# EasyEDA Pro project MyDeskThingy.epro

# Schematic Schematic1
Board Name: Board1; Create Date: 2026-04-02; Page Name: P1; Project Name: MyDeskThingy; Schematic Name: Schematic1; Update Date: 2026-04-02; Company: EasyEDA.com; Page Size: A4; Version: V1.0
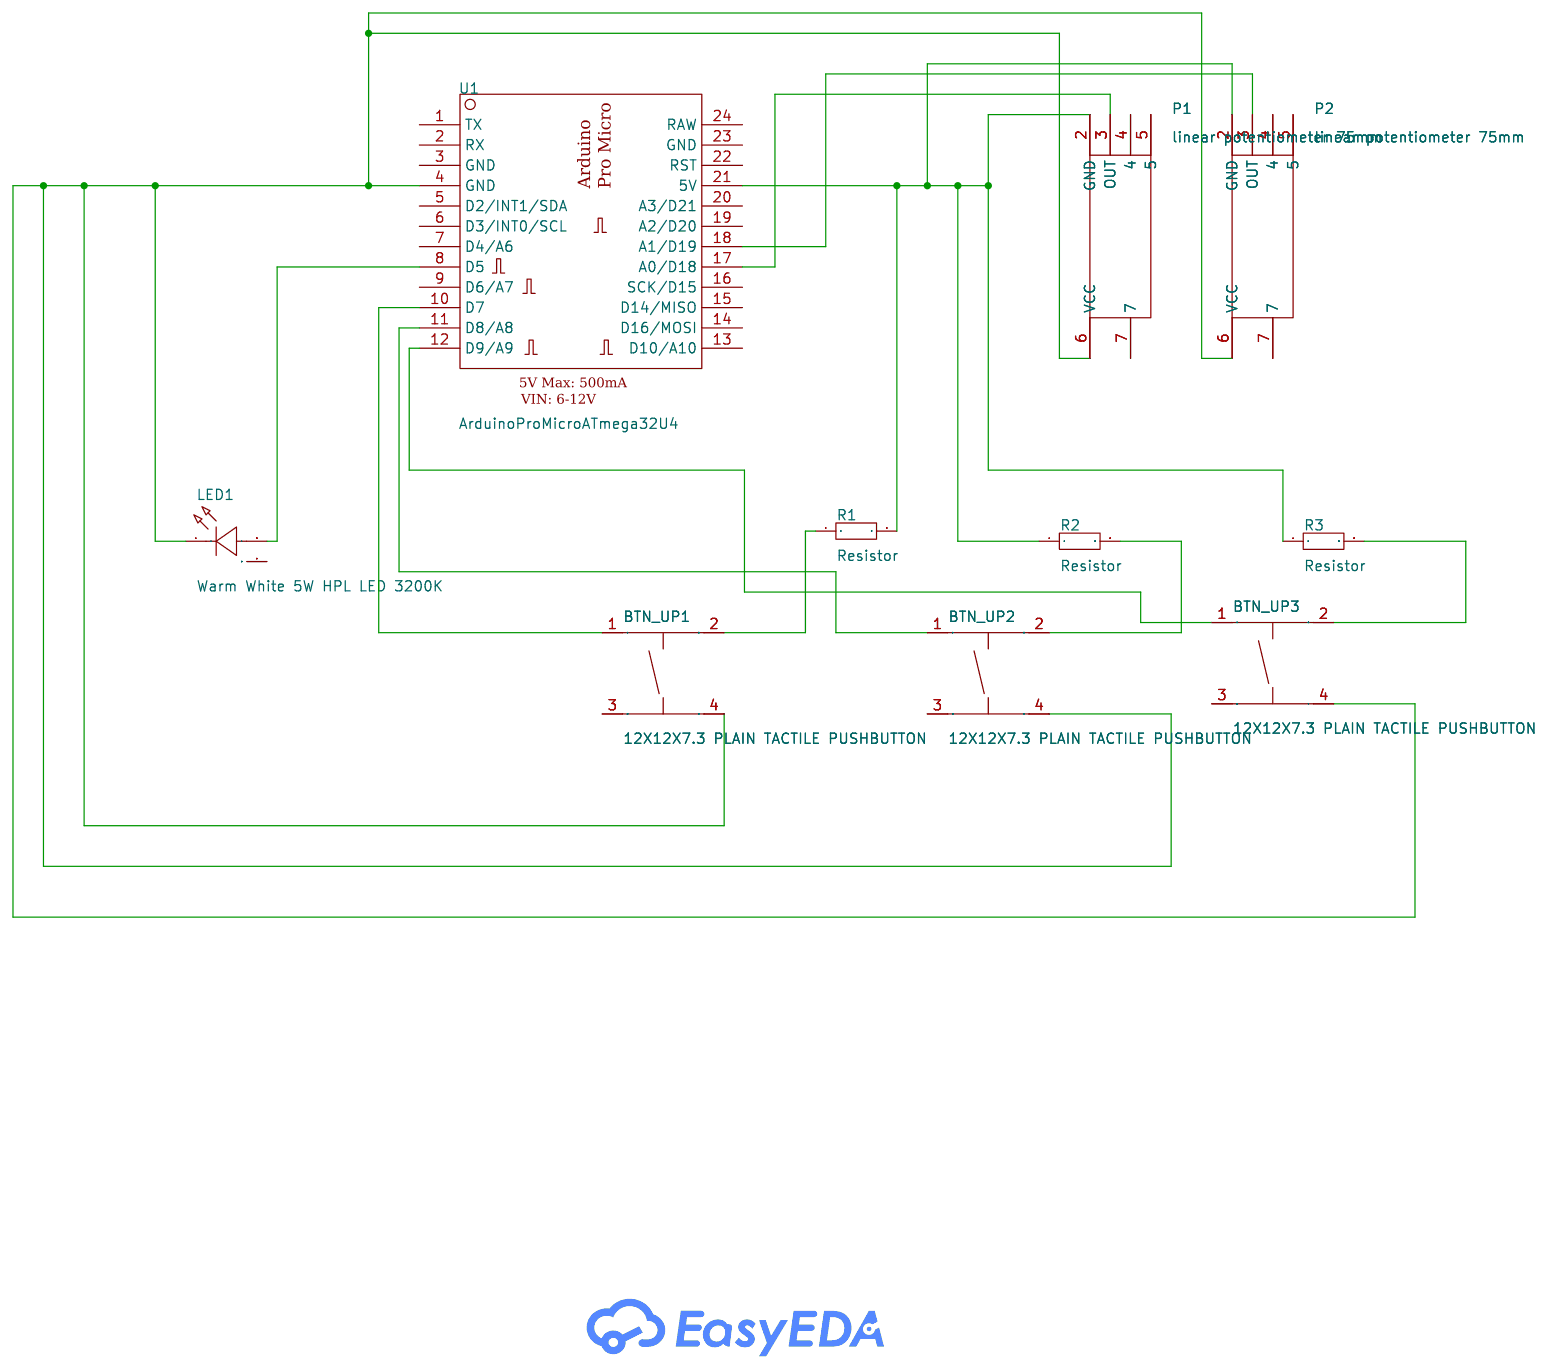
[diagram p0: schematic sheet]

## Parts
BTN_UP1  12X12X7.3 PLAIN TACTILE PUSHBUTTON  [SW-TH_4P-L12.0-W12.0-P5.00-LS12.5]
BTN_UP2  12X12X7.3 PLAIN TACTILE PUSHBUTTON  [SW-TH_4P-L12.0-W12.0-P5.00-LS12.5]
BTN_UP3  12X12X7.3 PLAIN TACTILE PUSHBUTTON  [SW-TH_4P-L12.0-W12.0-P5.00-LS12.5]
LED1  Warm White 5W HPL LED 3200K  [LED-SMD_HL-EF45W1NAMS_BIG]
P1  linear potentiometer 75mm  [MY Slide Pot 75mm]  (no BOM)
P2  linear potentiometer 75mm  [MY Slide Pot 75mm]  (no BOM)
R1  Resistor  [Resistor 1/8w 7mm metal film]
R2  Resistor  [Resistor 1/8w 7mm metal film]
R3  Resistor  [Resistor 1/8w 7mm metal film]
U1  ArduinoProMicroATmega32U4  [ARDUINOPROMICRO]

## Library data of the parts
BTN_UP1-BTN_UP3 = 12X12X7.3 PLAIN TACTILE PUSHBUTTON: Supplier: LCSC; Supplier Part: C10861; Manufacturer: Boom Precision Elec; JLCPCB Part Class: Extend; Paste Type: expand
LED1 = LC-5WW-C45: 2500K - 3500K, 6-7V, 600-700mA, Lumen 450-500 LM; Manufacturer: LCFOCUS; Supplier: LCFOCUS; Product Link: https://www.aliexpress.com/item/32881559687.html
P1 P2 = Slide Pot 75mm
R1-R3 = resistor: Supplier: LCSC; Manufacturer: UNI-ROYAL(Uniroyal Elec); Manufacturer Part: 1206W4F1002T5E; Supplier Part: C17902; Resistance: 10KΩ; JLCPCB Part Class: Basic Part; Datasheet: https://datasheet.lcsc.com/lcsc/2206010145_UNI-ROYAL-Uniroyal-Elec-1206W4F1002T5E_C17902.pdf
U1 = ArduinoProMicroATmega32U4

## Nets
$1N561: BTN_UP1.4 BTN_UP2.4 BTN_UP3.4 LED1.1(K) P1.6(VCC) P2.6(VCC) U1.4(GND)
$1N796: BTN_UP2.2 R2.2
$1N803: BTN_UP3.2 R3.2
$1N946: BTN_UP1.2 R1.1
$1N950: LED1.2(A) U1.8(D5)
$1N987: BTN_UP1.1 U1.10(D7)
$1N1002: BTN_UP2.1 U1.11(D8/A8)
$1N1010: BTN_UP3.1 U1.12(D9/A9)
$1N1032: P1.2(GND) P2.2(GND) R1.2 R2.1 R3.1 U1.21(5V)
$1N1123: P1.3(OUT) U1.17(A0/D18)
$1N1130: P2.3(OUT) U1.18(A1/D19)

Not connected (* = marked no-connect by the designer): BTN_UP1 3; BTN_UP2 3; BTN_UP3 3; LED1 3; P1 4 5 7; P2 4 5 7; U1 1(TX) 2(RX) 3(GND) 5(D2/INT1/SDA) 6(D3/INT0/SCL) 7(D4/A6) 9(D6/A7) 13(D10/A10) 14(D16/MOSI) 15(D14/MISO) 16(SCK/D15) 19(A2/D20) 20(A3/D21) 22(RST) 23(GND) 24(RAW)

# Board PCB1
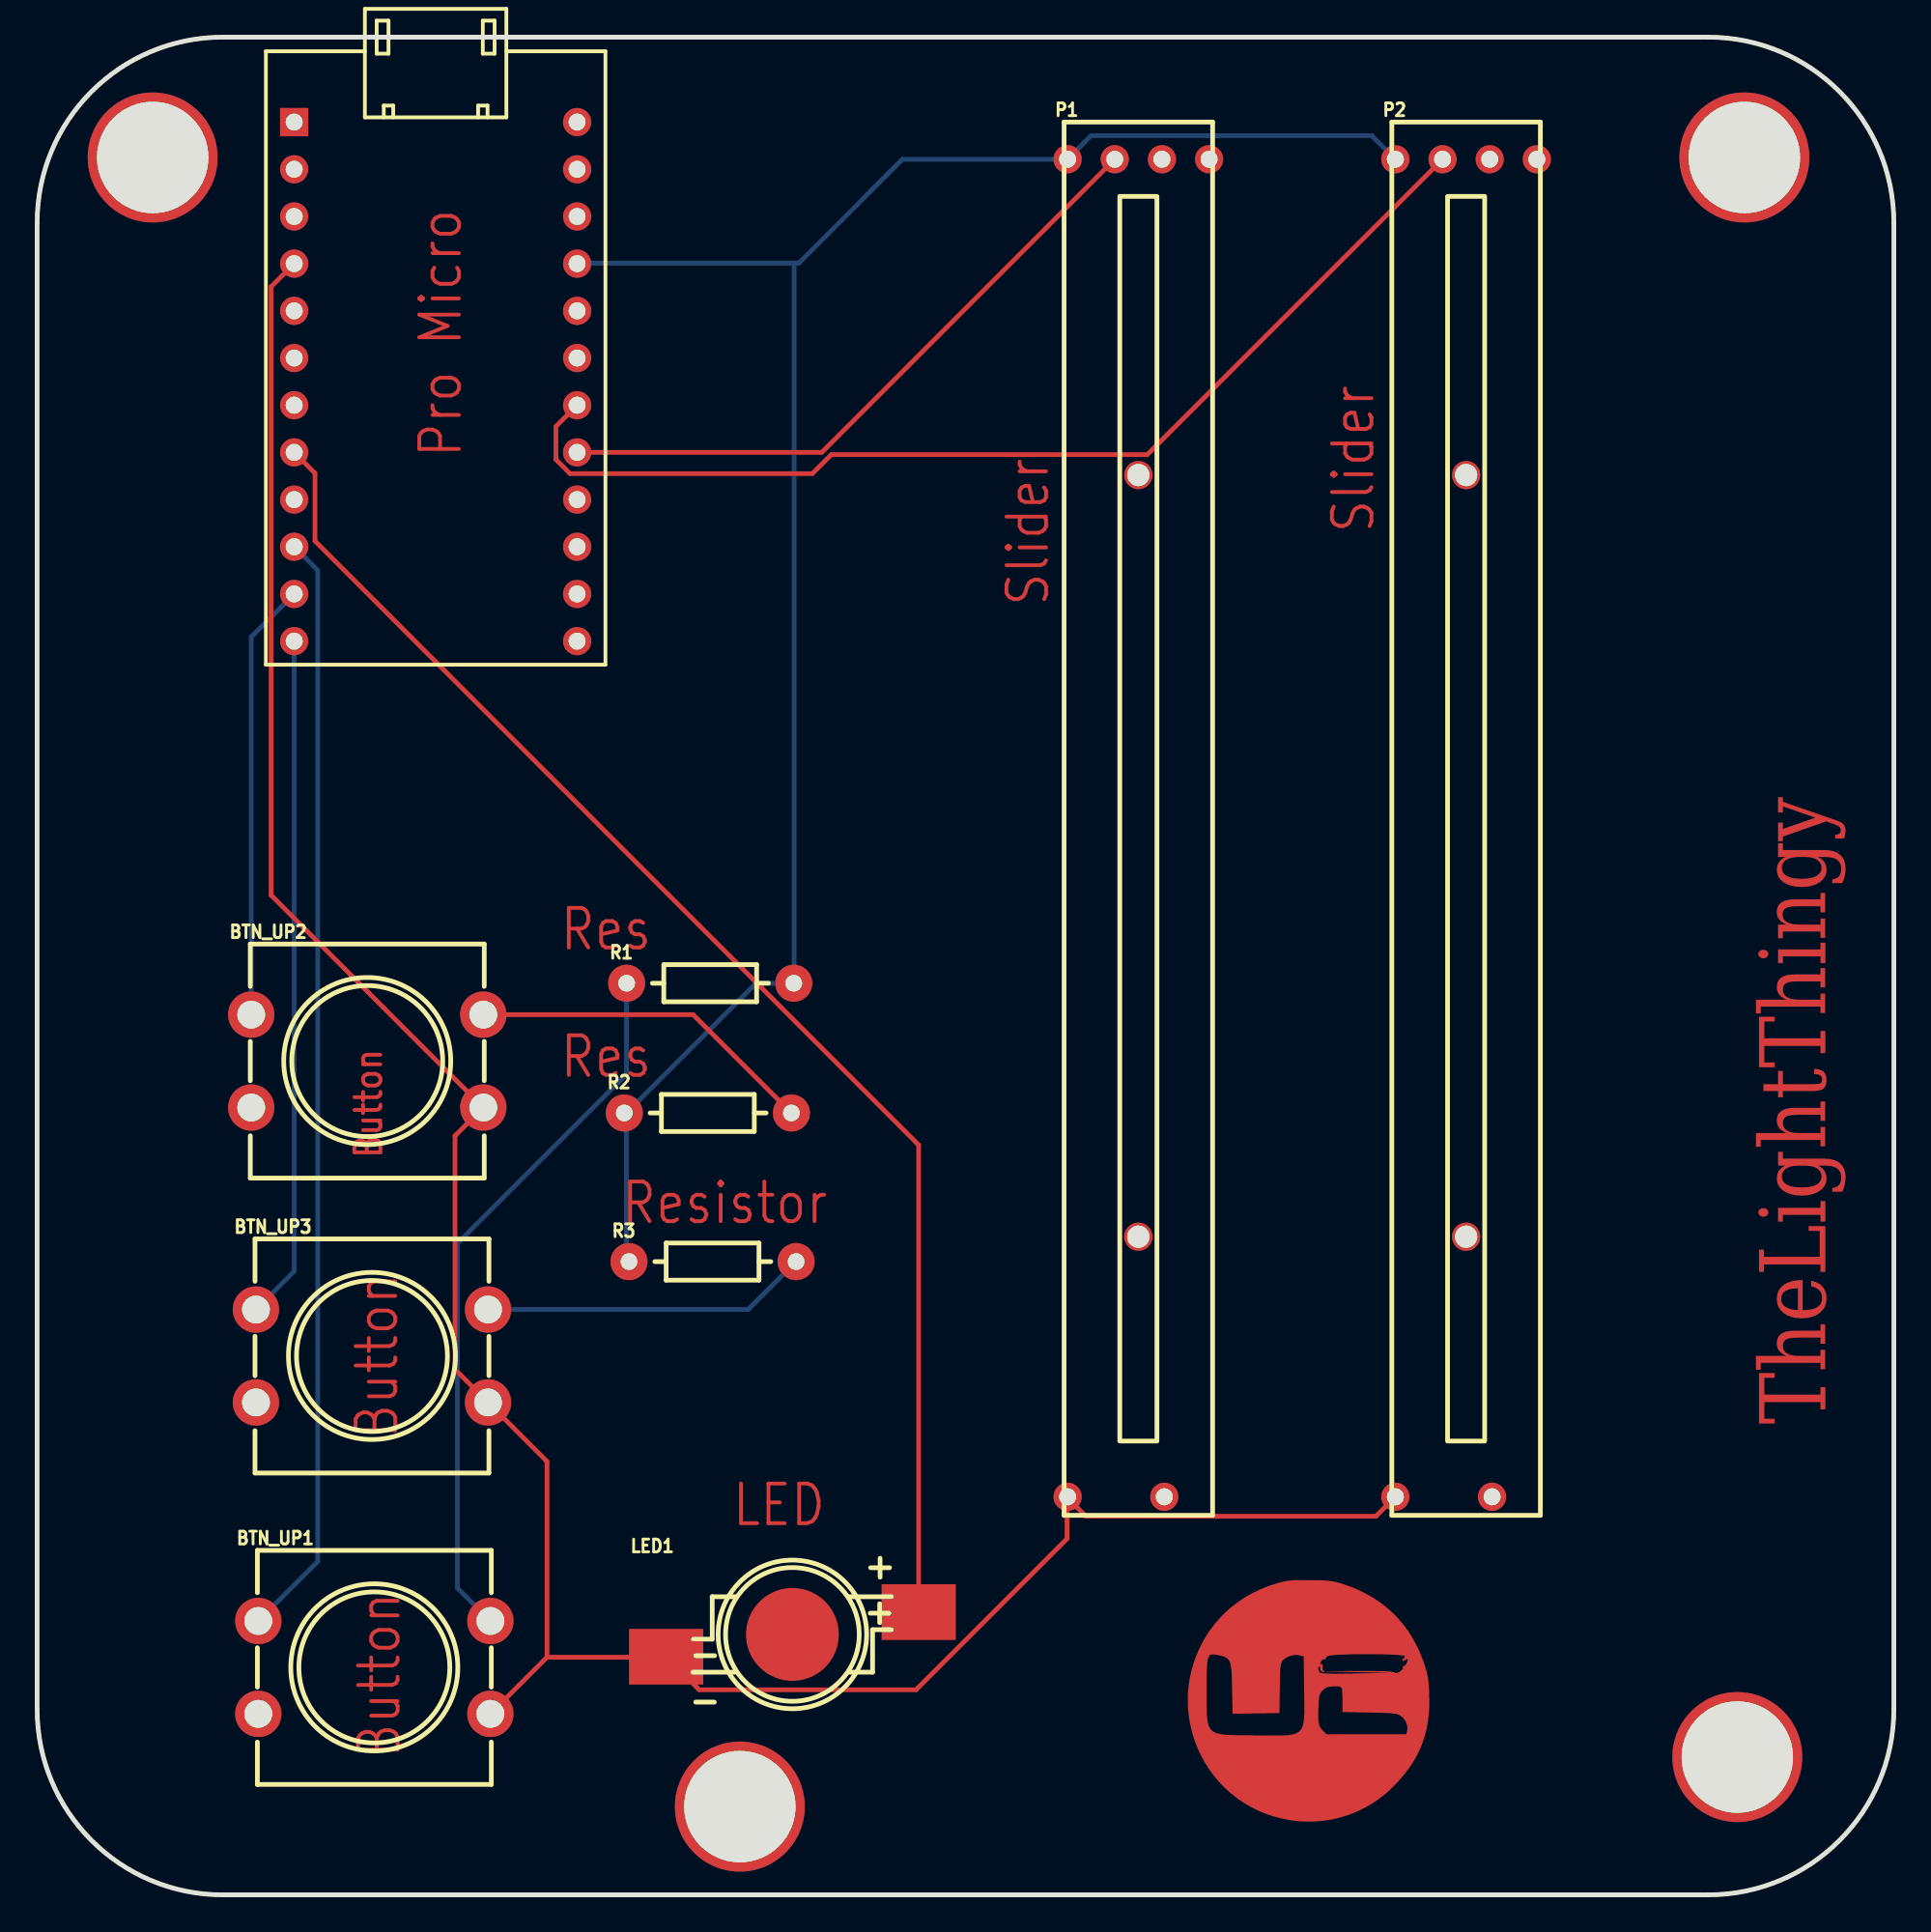
[diagram p1: board, top side]
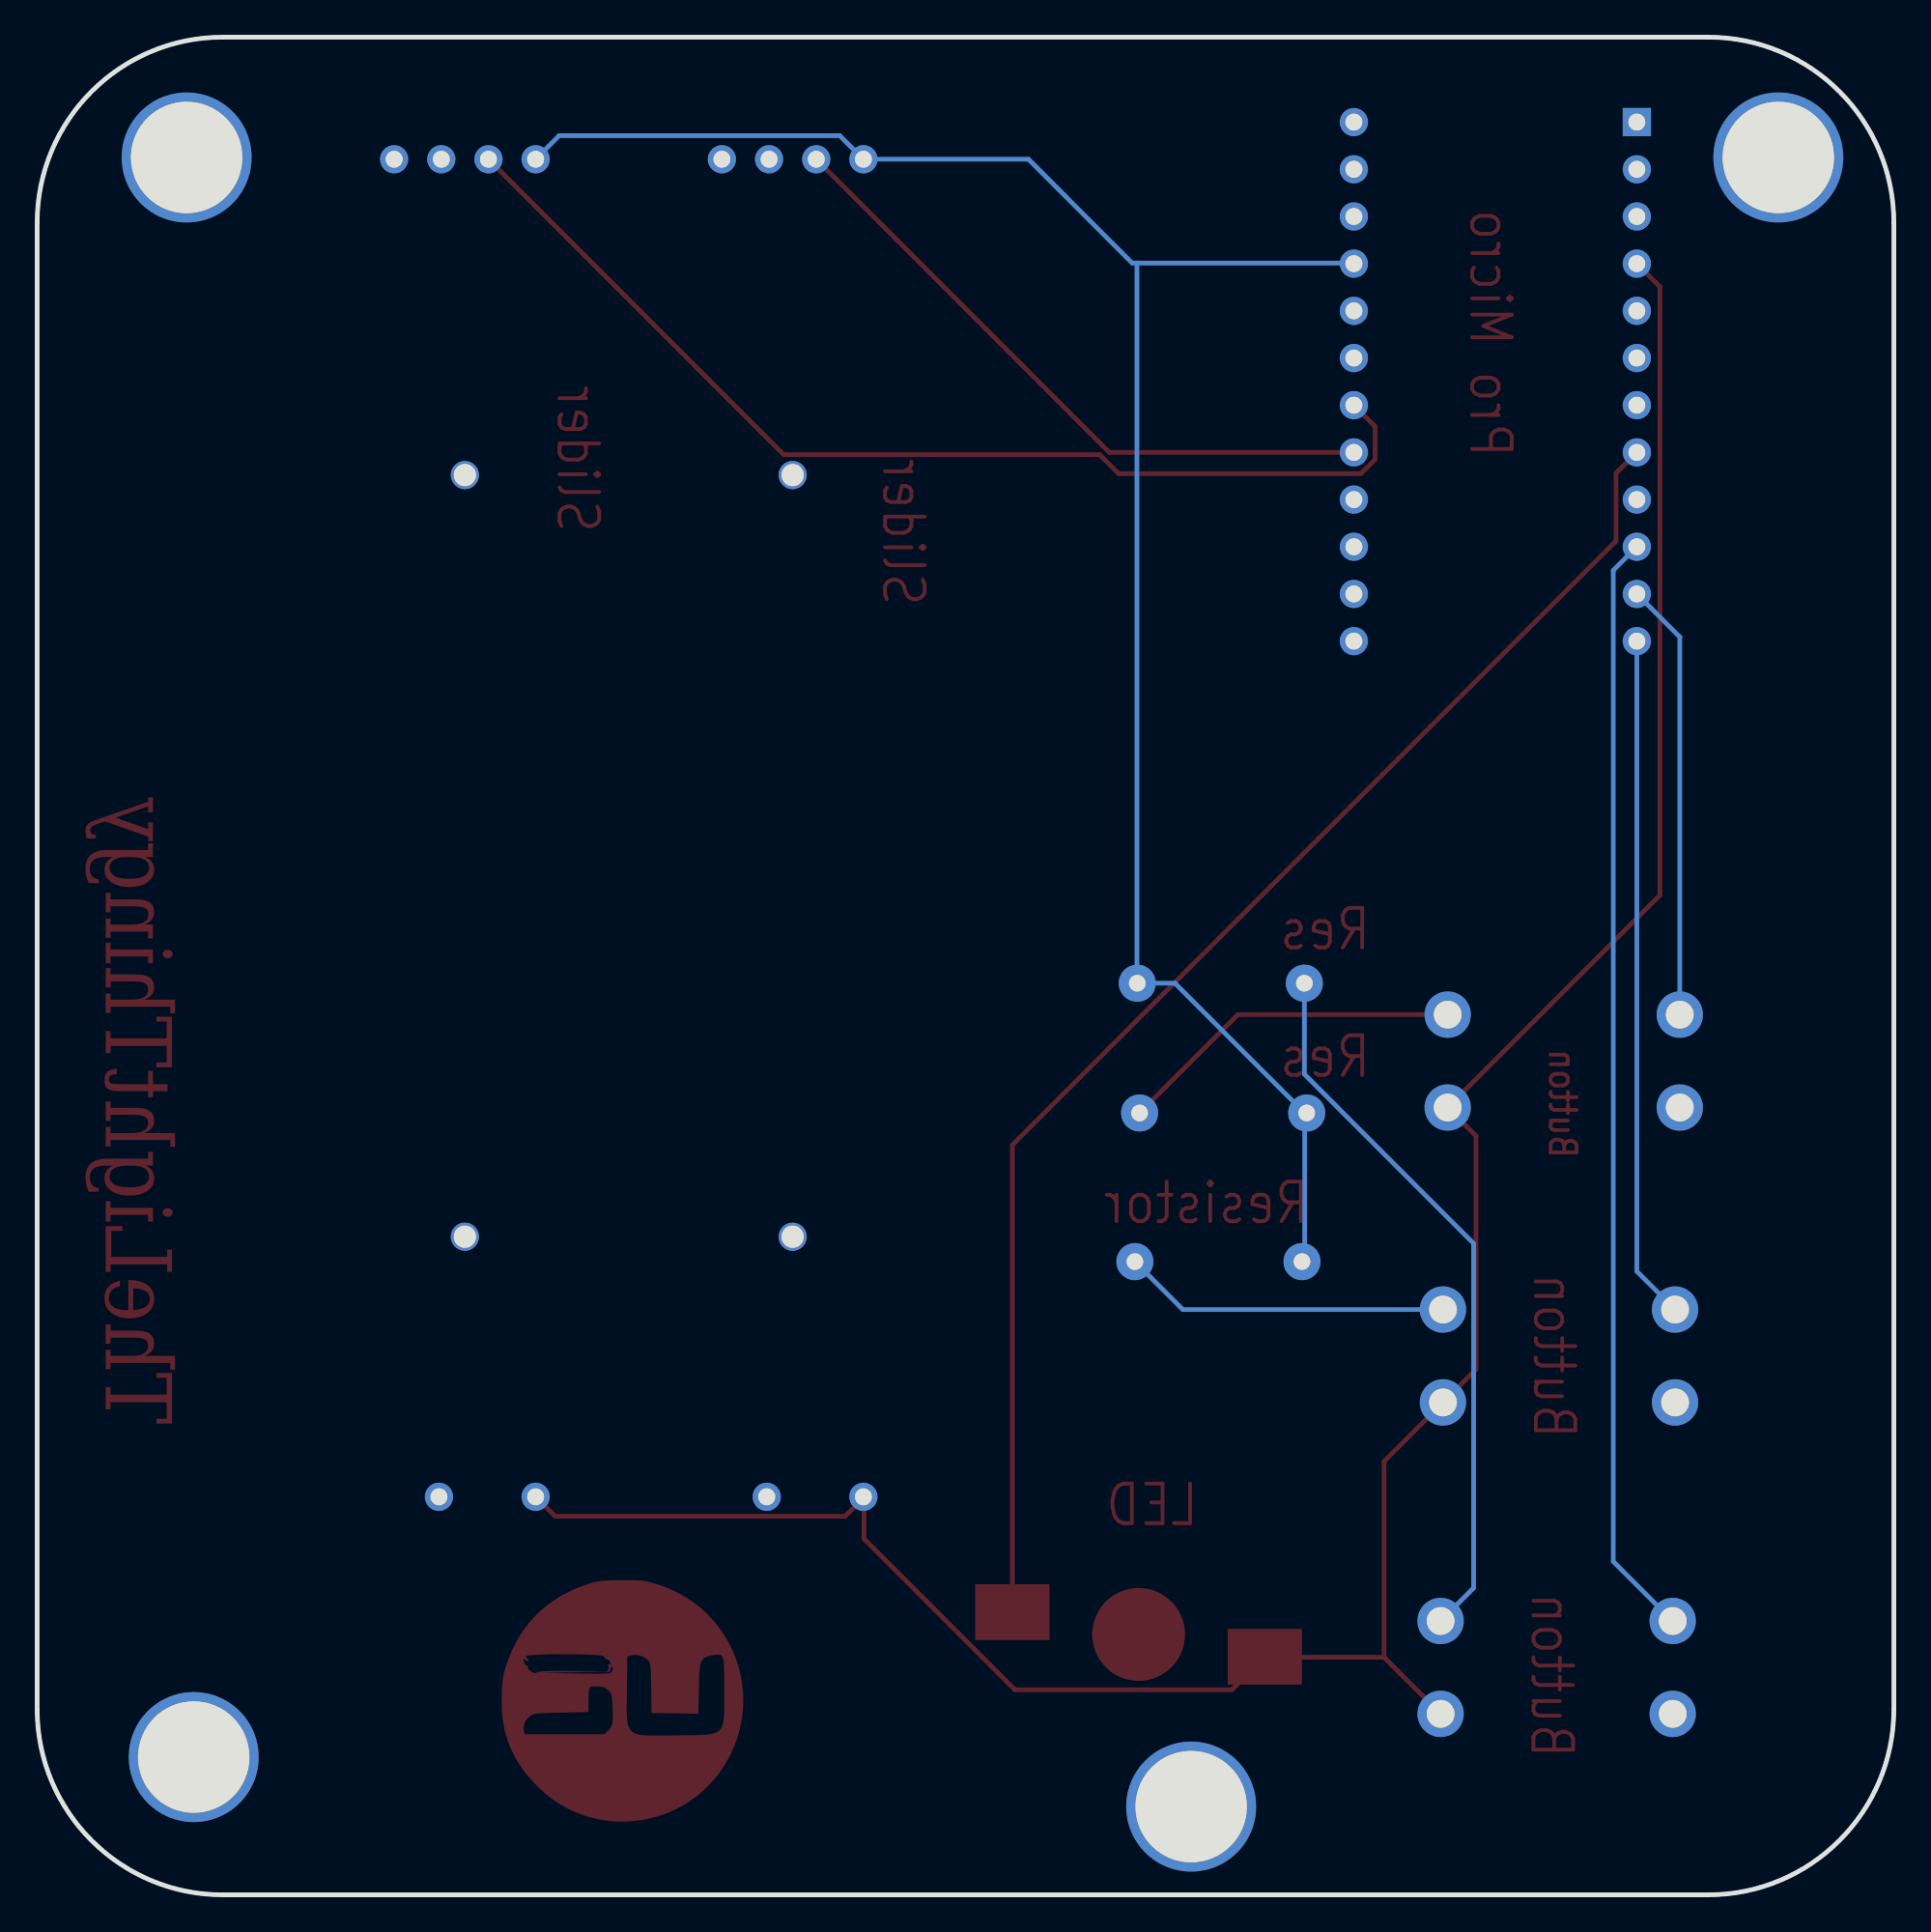
[diagram p2: board, bottom side, seen from below]

Outline 100 x 100 mm; copper layers: Top Layer, Bottom Layer. Coordinates in mm from the lower left corner of the outline.
Outline path: 0,90 0,10 arc(2.93,2.93) 10,0 90,0 arc(97.07,2.93) 100,10 100,90 arc(97.07,97.07) 90,100 10,100 arc(2.93,97.07) 0,90
Stack: Top Layer 0.035mm / Dielectric1 1.51mm FR4 er 4.5 / Bottom Layer 0.035mm

## Design rules (mm)
template: JLCPCB Capability(Two Layers Board)
spacing copperThickness1oz (default): track to track 0.102, other pairs 0.152 to 0.3
spacing copperThickness2oz: track to track 0.203, other pairs 0.152 to 0.3
track width copperThickness1oz (default): min 0.127, default 0.254, max 2.54
track width copperThickness2oz: min 0.203, default 0.254, max 2.54
differential pair differentialPair (default): width min 0.127, default 0.254, max 2.54; gap min 0.152, default 0.152
via viaSize (default): diameter min 0.5, default 0.61, max 10; hole min 0.3, default 0.305, max 6.3

## Placement (name value [footprint] x y rotation side)
BTN_UP1  12X12X7.3 PLAIN TACTILE PUSHBUTTON  [SW-TH_4P-L12.0-W12.0-P5.00-LS12.5]  18.16 12.24 0 top
BTN_UP2  12X12X7.3 PLAIN TACTILE PUSHBUTTON  [SW-TH_4P-L12.0-W12.0-P5.00-LS12.5]  17.78 44.88 0 top
BTN_UP3  12X12X7.3 PLAIN TACTILE PUSHBUTTON  [SW-TH_4P-L12.0-W12.0-P5.00-LS12.5]  18.03 29.01 0 top
LED1  Warm White 5W HPL LED 3200K  [LED-SMD_HL-EF45W1NAMS_BIG]  40.68 14.02 0 top
NOREF  -  [Pad_e164]  6.22 93.52 0 top
NOREF#2  -  [Pad_e166]  91.95 93.52 0 top
NOREF#3  -  [Pad_e168]  37.85 4.75 0 top
NOREF#4  -  [Pad_e167]  91.57 7.42 0 top
P1  linear potentiometer 75mm  [MY Slide Pot 75mm]  59.31 95.43 0 top
P2  linear potentiometer 75mm  [MY Slide Pot 75mm]  76.96 95.43 0 top
R1  Resistor  [Resistor 1/8w 7mm metal film]  31.75 49.07 0 top
R2  Resistor  [Resistor 1/8w 7mm metal film]  31.62 42.09 0 top
R3  Resistor  [Resistor 1/8w 7mm metal film]  31.88 34.09 0 top
U1  ArduinoProMicroATmega32U4  [ARDUINOPROMICRO]  21.46 82.73 0 top

## Footprints (pads in the part's own frame, mm; a bottom-side part is the same pattern mirrored in y, then rotated)
ARDUINOPROMICRO
  rect 1.524x1.524 hole 0.914: 1(-7.62,12.7)
  round 1.524 hole 0.914: 2(-7.62,10.16) 3(-7.62,7.62) 4(-7.62,5.08) 5(-7.62,2.54) 6(-7.62,0) 7(-7.62,-2.54) 8(-7.62,-5.08) 9(-7.62,-7.62) 10(-7.62,-10.16) 11(-7.62,-12.7) 12(-7.62,-15.24) 13(7.62,-15.24) 14(7.62,-12.7) 15(7.62,-10.16) 16(7.62,-7.62) 17(7.62,-5.08) 18(7.62,-2.54) 19(7.62,0) 20(7.62,2.54) 21(7.62,5.08) 22(7.62,7.62) 23(7.62,10.16) 24(7.62,12.7)
LED-SMD_HL-EF45W1NAMS_BIG
  rect 4x3 smd: 1(-6.8,-1.2) 2(6.8,1.2)
  round 5 smd: 3(0,0)
MY Slide Pot 75mm
  round 1.524 hole 0.914: 2(-3.81,-2) 3(-1.27,-2) 4(1.27,-2) 5(3.81,-2) 6(-3.81,-74) 7(1.397,-74)
  round 1.524 hole 1.2: 8(0,-19) 9(0,-60)
Pad_e164
  round 7 hole 6: 1(0,0)
Pad_e166
  round 7 hole 6: 1(0,0)
Pad_e167
  round 7 hole 6: 1(0,0)
Pad_e168
  round 7 hole 6: 1(0,0)
Resistor 1/8w 7mm metal film
  round 2 hole 0.9: 1(0,0) 2(9,0)
SW-TH_4P-L12.0-W12.0-P5.00-LS12.5
  round 2.5 hole 1.5: 1(-6.25,2.5) 2(6.25,2.5) 3(-6.25,-2.5) 4(6.25,-2.5)

## Nets
As in the schematic.

Pads without a net: BTN_UP1 3; BTN_UP2 3; BTN_UP3 3; LED1 3; NOREF 1; NOREF#2 1; NOREF#3 1; NOREF#4 1; P1 4 5 7 8 9; P2 4 5 7 8 9; U1 1 2 3 5 6 7 9 13 14 15 16 19 20 22 23 24

## Routing (per net, layer and track width the routed paths; a pad name or vN(x,y) marks a point on that pad's centre or on a via; arc(x,y) is an arc through that point)
$1N561: length 140.2
  Top Layer w0.254: 27.46,12.79 33.85,12.79 33.88,12.82 35.65,11.04 47.34,11.04 55.47,19.17 55.47,21.4 ; 27.46,12.79 27.46,23.33 BTN_UP3.4 22.51,28.28 22.51,40.86 BTN_UP2.4 12.6,53.81 12.6,86.56 U1.4 ; 27.46,12.79 BTN_UP1.4 ; 55.47,21.4 P1.6 ; 55.47,21.4 56.48,20.38 72.1,20.38 P2.6
$1N796: length 18.8
  Top Layer w0.254: R2.2 35.33,47.38 BTN_UP2.2
$1N803: length 17.7
  Bottom Layer w0.254: BTN_UP3.2 38.3,31.51 R3.2
$1N946: length 38.8
  Bottom Layer w0.254: BTN_UP1.2 22.63,16.52 22.63,35.06 31.75,44.18 R1.1
$1N950: length 76.4
  Top Layer w0.254: U1.8 14.97,76.53 14.97,72.88 47.48,40.36 LED1.2
$1N987: length 59.7
  Bottom Layer w0.254: U1.10 15.11,71.3 15.11,17.94 BTN_UP1.1
$1N1002: length 23.6
  Bottom Layer w0.254: BTN_UP2.1 11.53,67.72 U1.11
$1N1010: length 36.8
  Bottom Layer w0.254: BTN_UP3.1 13.84,33.57 U1.12
$1N1032: length 106.3
  Bottom Layer w0.254: 40.77,87.84 40.77,49.09 R1.2 38.72,49.07 31.73,42.09 ; 40.77,87.84 29.11,87.84 U1.21 ; 40.77,87.84 41.02,87.84 46.61,93.43 P1.2 56.77,94.7 71.88,94.7 P2.2 ; R3.1 31.73,34.23 31.73,42.09 ; 31.73,42.09 R2.1
$1N1123: length 35.5
  Top Layer w0.254: U1.17 42.26,77.65 P1.3
$1N1130: length 58.5
  Top Layer w0.254: P2.3 59.79,77.53 42.77,77.53 41.75,76.5 28.7,76.5 27.94,77.27 27.94,79.05 U1.18

Small or netless copper shapes (teardrops, artwork), in the pictures only: 1 on Top Layer

## Text on the board
Top Layer: Button | Res | Resistor | LED | Pro Micro | Slider | TheLightThingy
